# Altium schematic sheet Vertical.SchDoc
size Letter; Organization: Ploopy Corporation; Address1: 137-1140 Burnhamthorpe Road W; Address3: Ontario; DocumentNumber: 1; Revision: R1.007; SheetNumber: 1; SheetTotal: 5
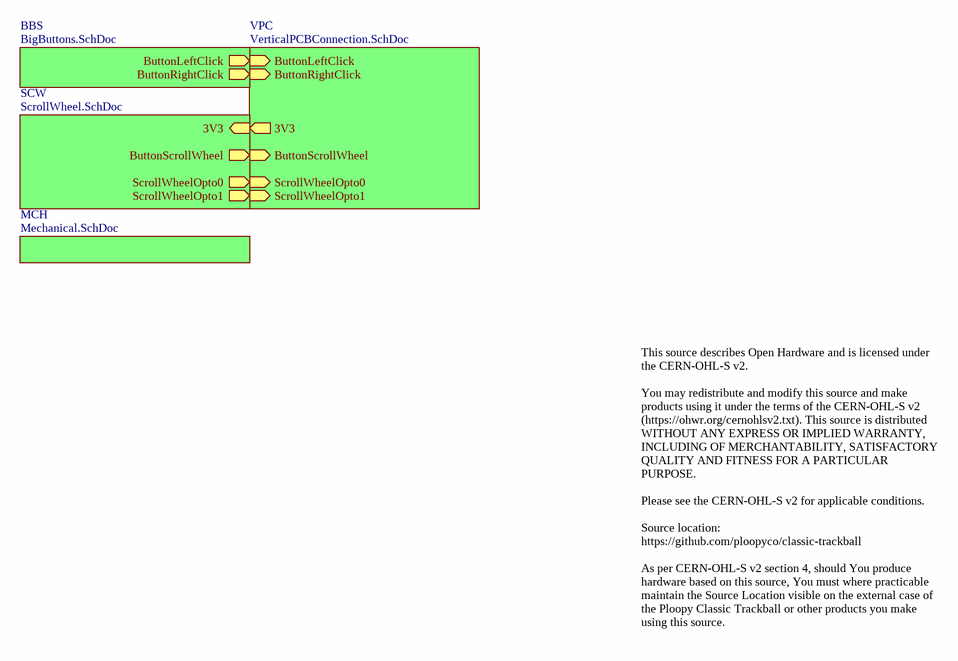
[diagram p0: Vertical.SchDoc]

## Sub-sheets
BBS = BigButtons.SchDoc: ButtonRightClick (out), ButtonLeftClick (out)
MCH = Mechanical.SchDoc: no entries
SCW = ScrollWheel.SchDoc: 3V3 (in), ScrollWheelOpto1 (out), ScrollWheelOpto0 (out), ButtonScrollWheel (out)
VPC = VerticalPCBConnection.SchDoc: 3V3 (out), ButtonRightClick (in), ButtonLeftClick (in), ScrollWheelOpto1 (in), ScrollWheelOpto0 (in), ButtonScrollWheel (in)

## Nets
(unnamed): sheet VPC/3V3, sheet SCW/3V3
(unnamed): sheet VPC/ButtonRightClick, sheet BBS/ButtonRightClick
(unnamed): sheet VPC/ButtonLeftClick, sheet BBS/ButtonLeftClick
(unnamed): sheet VPC/ScrollWheelOpto1, sheet SCW/ScrollWheelOpto1
(unnamed): sheet VPC/ScrollWheelOpto0, sheet SCW/ScrollWheelOpto0
(unnamed): sheet VPC/ButtonScrollWheel, sheet SCW/ButtonScrollWheel

## Notes on the sheet
- This source describes Open Hardware and is licensed under the CERN-OHL-S v2.
  You may redistribute and modify this source and make products using it under the terms of the CERN-OHL-S v2 (https://ohwr.org/cernohlsv2.txt). This source is distributed WITHOUT ANY EXPRESS OR IMPLIED WARRANTY, INCLUDING OF MERCHANTABILITY, SATISFACTORY QUALITY AND FITNESS FOR A PARTICULAR PURPOSE.
  Please see the CERN-OHL-S v2 for applicable conditions.
  Source location:  https://github.com/ploopyco/classic-trackball
  As per CERN-OHL-S v2 section 4, should You produce hardware based on this source, You must where practicable maintain the Source Location visible on the external case of the Ploopy Classic Trackball or other products you make using this source.
- Copyright Ploopy Corporation 2024
- Licensed under the CERN-OHL-S v2
- http://ohwr.org/cernohl
- Title:
- PCB:
- Version:
- Ploopy Corporation
- Mississauga ON L5C 0A3
- 137-1140 Burnhamthorpe Road W
- Date:
- Time:
- Sheet
- of
- Canada